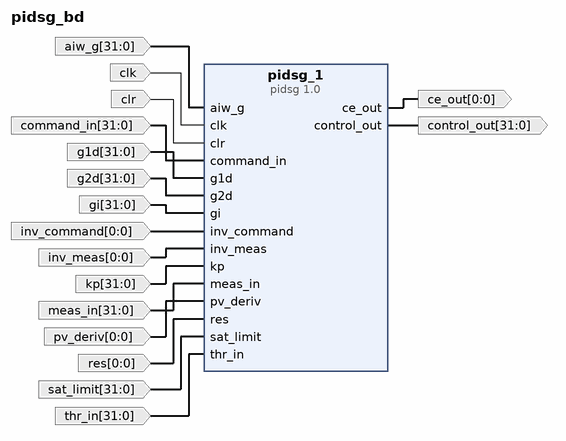
[diagram p0: block diagram of the top level]
# Vivado block design pidsg_bd, xc7z030sbg485-1, Vivado 2020.2
create_bd_design pidsg_bd

create_bd_port -dir I -from 31 -to 0 -type data aiw_g
create_bd_port -dir O -from 0 -to 0 -type data ce_out
create_bd_port -dir I -type clk clk
create_bd_port -dir I -type data clr
create_bd_port -dir I -from 31 -to 0 -type data command_in
create_bd_port -dir O -from 31 -to 0 -type data control_out
create_bd_port -dir I -from 31 -to 0 -type data g1d
create_bd_port -dir I -from 31 -to 0 -type data g2d
create_bd_port -dir I -from 31 -to 0 -type data gi
create_bd_port -dir I -from 0 -to 0 -type data inv_command
create_bd_port -dir I -from 0 -to 0 -type data inv_meas
create_bd_port -dir I -from 31 -to 0 -type data kp
create_bd_port -dir I -from 31 -to 0 -type data meas_in
create_bd_port -dir I -from 0 -to 0 -type data pv_deriv
create_bd_port -dir I -from 0 -to 0 -type data res
create_bd_port -dir I -from 31 -to 0 -type data sat_limit
create_bd_port -dir I -from 31 -to 0 -type data thr_in

create_bd_cell -type ip -vlnv MaxIV:Panda_SysGen:pidsg:1.0 pidsg_1

# ---- connections ----

connect_bd_net [get_bd_ports aiw_g] [get_bd_pins pidsg_1/aiw_g]
connect_bd_net [get_bd_pins pidsg_1/ce_out] [get_bd_ports ce_out]
connect_bd_net [get_bd_ports clk] [get_bd_pins pidsg_1/clk]
connect_bd_net [get_bd_ports clr] [get_bd_pins pidsg_1/clr]
connect_bd_net [get_bd_ports command_in] [get_bd_pins pidsg_1/command_in]
connect_bd_net [get_bd_pins pidsg_1/control_out] [get_bd_ports control_out]
connect_bd_net [get_bd_ports g1d] [get_bd_pins pidsg_1/g1d]
connect_bd_net [get_bd_ports g2d] [get_bd_pins pidsg_1/g2d]
connect_bd_net [get_bd_ports gi] [get_bd_pins pidsg_1/gi]
connect_bd_net [get_bd_ports inv_command] [get_bd_pins pidsg_1/inv_command]
connect_bd_net [get_bd_ports inv_meas] [get_bd_pins pidsg_1/inv_meas]
connect_bd_net [get_bd_ports kp] [get_bd_pins pidsg_1/kp]
connect_bd_net [get_bd_ports meas_in] [get_bd_pins pidsg_1/meas_in]
connect_bd_net [get_bd_ports pv_deriv] [get_bd_pins pidsg_1/pv_deriv]
connect_bd_net [get_bd_ports res] [get_bd_pins pidsg_1/res]
connect_bd_net [get_bd_ports sat_limit] [get_bd_pins pidsg_1/sat_limit]
connect_bd_net [get_bd_ports thr_in] [get_bd_pins pidsg_1/thr_in]

validate_bd_design
save_bd_design
